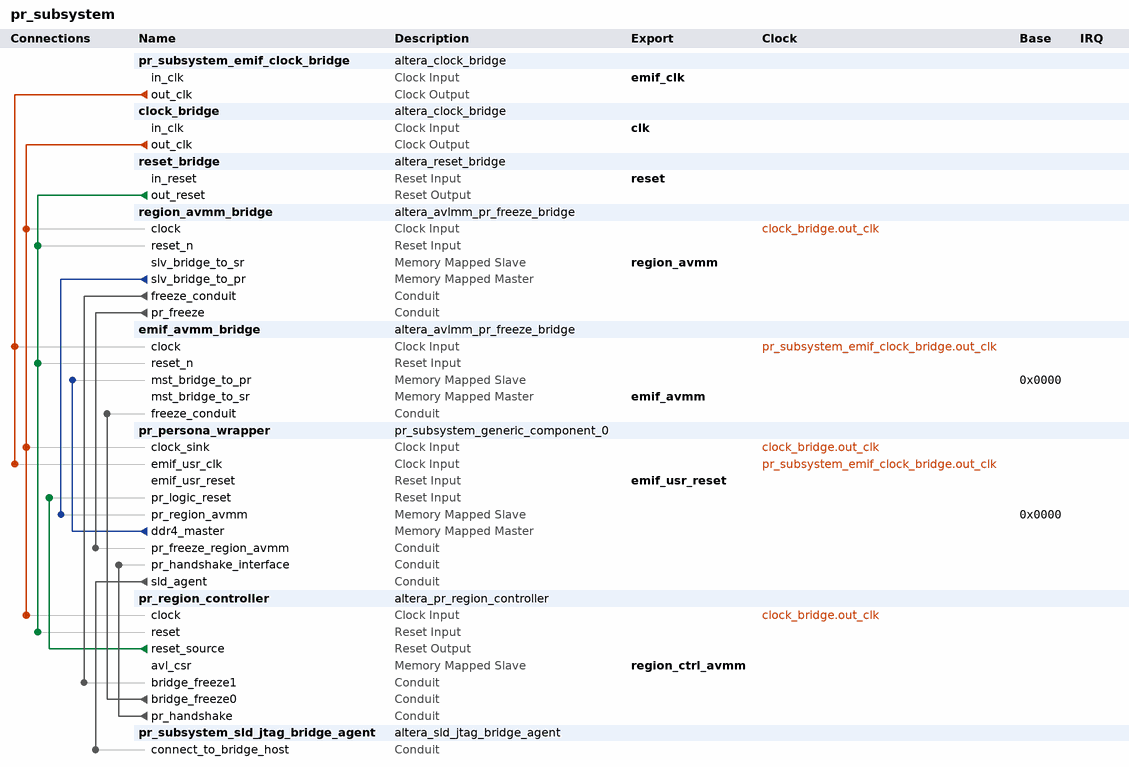
[diagram p0: system contents]
# Platform Designer (Qsys) system pr_subsystem, Arria 10 10AX115S2F45I1SG
# Parameters at their usual value, and those the tool derives, are not listed.
package require -exact qsys 1.0
create_system pr_subsystem
set_project_property DEVICE_FAMILY {Arria 10}
set_project_property DEVICE 10AX115S2F45I1SG

add_component pr_subsystem_emif_clock_bridge ip/pr_subsystem/pr_subsystem_emif_clock_bridge.ip altera_clock_bridge pr_subsystem_emif_clock_bridge 18.1
load_component pr_subsystem_emif_clock_bridge
set_component_parameter_value DERIVED_CLOCK_RATE 266666750
set_component_parameter_value EXPLICIT_CLOCK_RATE 0
save_component

add_component clock_bridge ip/pr_subsystem/pr_subsystem_clock_bridge_0.ip altera_clock_bridge clock_bridge 18.1
load_component clock_bridge
set_component_parameter_value DERIVED_CLOCK_RATE 250000000
set_component_parameter_value EXPLICIT_CLOCK_RATE 0
save_component

add_component reset_bridge ip/pr_subsystem/pr_subsystem_reset_bridge_0.ip altera_reset_bridge reset_bridge 18.1
load_component reset_bridge
set_component_parameter_value ACTIVE_LOW_RESET 1
set_component_parameter_value SYNCHRONOUS_EDGES none
set_component_parameter_value SYNC_RESET 0
save_component

add_component region_avmm_bridge ip/pr_subsystem/pr_subsystem_freeze_bridge_cra.ip altera_avlmm_pr_freeze_bridge region_avmm_bridge 18.1
load_component region_avmm_bridge
set_component_parameter_value Interface_Type {Avalon-MM Slave}
set_component_parameter_value ENABLE_FREEZE_FROM_PR_REGION true
set_component_parameter_value ENABLE_TRAFFIC_TRACKING false
set_component_parameter_value slv_bridge_signal_name_DERIVED address,beginbursttransfer,byteenable,debugaccess,read,write,readdata,writedata,waitrequest,readdatavalid,burstcount,response,lock,writeresponsevalid
set_component_parameter_value slv_bridge_signal_Enable Yes,No,Yes,Yes,Yes,Yes,Yes,Yes,Yes,Yes,Yes,No,No,No
set_component_parameter_value SLV_BRIDGE_ADDR_WIDTH 16
set_component_parameter_value SLV_BRIDGE_SYMBOL_WIDTH 8
set_component_parameter_value SLV_BRIDGE_BYTEEN_WIDTH 4
set_component_parameter_value SLV_BRIDGE_BURSTCOUNT_WIDTH 1
set_component_parameter_value SLV_BRIDGE_BURST_LINEWRAP false
set_component_parameter_value SLV_BRIDGE_CONSTANTBURSTBEHAVIOR false
set_component_parameter_value SLV_BRIDGE_BURST_BNDR_ONLY false
set_component_parameter_value SLV_BRIDGE_MAX_PENDING_READS 1
set_component_parameter_value SLV_BRIDGE_MAX_PENDING_WRITES 0
set_component_parameter_value SLV_BRIDGE_FIX_READ_LATENCY 0
set_component_parameter_value SLV_BRIDGE_READ_WAIT_TIME 1
set_component_parameter_value SLV_BRIDGE_WRITE_WAIT_TIME 0
set_component_parameter_value SLV_BRIDGE_ADDRESS_UNITS SYMBOLS
set_component_parameter_value mst_bridge_signal_name_DERIVED address,beginbursttransfer,byteenable,debugaccess,read,write,readdata,writedata,waitrequest,readdatavalid,burstcount,response,lock,writeresponsevalid
set_component_parameter_value mst_bridge_signal_Enable Yes,Yes,Yes,Yes,Yes,Yes,Yes,Yes,Yes,Yes,Yes,Yes,Yes,Yes
set_component_parameter_value MST_BRIDGE_ADDR_WIDTH 32
set_component_parameter_value MST_BRIDGE_SYMBOL_WIDTH 8
set_component_parameter_value MST_BRIDGE_BYTEEN_WIDTH 4
set_component_parameter_value MST_BRIDGE_BURSTCOUNT_WIDTH 3
set_component_parameter_value MST_BRIDGE_BURST_LINEWRAP true
set_component_parameter_value MST_BRIDGE_BURST_BNDR_ONLY true
set_component_parameter_value MST_BRIDGE_CONSTANTBURSTBEHAVIOR true
set_component_parameter_value MST_BRIDGE_MAX_PENDING_READS 1
set_component_parameter_value MST_BRIDGE_MAX_PENDING_WRITES 1
set_component_parameter_value MST_BRIDGE_FIX_READ_LATENCY 0
set_component_parameter_value MST_BRIDGE_READ_WAIT_TIME 1
set_component_parameter_value MST_BRIDGE_WRITE_WAIT_TIME 0
set_component_parameter_value MST_BRIDGE_ADDRESS_UNITS SYMBOLS
save_component

add_component emif_avmm_bridge ip/pr_subsystem/pr_subsystem_freeze_bridge_ddr4.ip altera_avlmm_pr_freeze_bridge emif_avmm_bridge 18.1
load_component emif_avmm_bridge
set_component_parameter_value Interface_Type {Avalon-MM Master}
set_component_parameter_value ENABLE_FREEZE_FROM_PR_REGION false
set_component_parameter_value ENABLE_TRAFFIC_TRACKING false
set_component_parameter_value slv_bridge_signal_name_DERIVED address,beginbursttransfer,byteenable,debugaccess,read,write,readdata,writedata,waitrequest,readdatavalid,burstcount,response,lock,writeresponsevalid
set_component_parameter_value slv_bridge_signal_Enable Yes,Yes,Yes,Yes,Yes,Yes,Yes,Yes,Yes,Yes,Yes,Yes,Yes,Yes
set_component_parameter_value SLV_BRIDGE_ADDR_WIDTH 32
set_component_parameter_value SLV_BRIDGE_SYMBOL_WIDTH 8
set_component_parameter_value SLV_BRIDGE_BYTEEN_WIDTH 4
set_component_parameter_value SLV_BRIDGE_BURSTCOUNT_WIDTH 3
set_component_parameter_value SLV_BRIDGE_BURST_LINEWRAP true
set_component_parameter_value SLV_BRIDGE_CONSTANTBURSTBEHAVIOR true
set_component_parameter_value SLV_BRIDGE_BURST_BNDR_ONLY true
set_component_parameter_value SLV_BRIDGE_MAX_PENDING_READS 1
set_component_parameter_value SLV_BRIDGE_MAX_PENDING_WRITES 1
set_component_parameter_value SLV_BRIDGE_FIX_READ_LATENCY 0
set_component_parameter_value SLV_BRIDGE_READ_WAIT_TIME 1
set_component_parameter_value SLV_BRIDGE_WRITE_WAIT_TIME 0
set_component_parameter_value SLV_BRIDGE_ADDRESS_UNITS SYMBOLS
set_component_parameter_value mst_bridge_signal_name_DERIVED address,beginbursttransfer,byteenable,debugaccess,read,write,readdata,writedata,waitrequest,readdatavalid,burstcount,response,lock,writeresponsevalid
set_component_parameter_value mst_bridge_signal_Enable Yes,No,Yes,No,Yes,Yes,Yes,Yes,Yes,Yes,Yes,No,No,No
set_component_parameter_value MST_BRIDGE_ADDR_WIDTH 25
set_component_parameter_value MST_BRIDGE_SYMBOL_WIDTH 8
set_component_parameter_value MST_BRIDGE_BYTEEN_WIDTH 64
set_component_parameter_value MST_BRIDGE_BURSTCOUNT_WIDTH 7
set_component_parameter_value MST_BRIDGE_BURST_LINEWRAP false
set_component_parameter_value MST_BRIDGE_BURST_BNDR_ONLY false
set_component_parameter_value MST_BRIDGE_CONSTANTBURSTBEHAVIOR false
set_component_parameter_value MST_BRIDGE_MAX_PENDING_READS 64
set_component_parameter_value MST_BRIDGE_MAX_PENDING_WRITES 0
set_component_parameter_value MST_BRIDGE_FIX_READ_LATENCY 0
set_component_parameter_value MST_BRIDGE_READ_WAIT_TIME 1
set_component_parameter_value MST_BRIDGE_WRITE_WAIT_TIME 0
set_component_parameter_value MST_BRIDGE_ADDRESS_UNITS WORDS
save_component

add_component pr_persona_wrapper {} pr_subsystem_generic_component_0 pr_persona_wrapper 1.0

add_component pr_region_controller ip/pr_subsystem/pr_subsystem_pr_region_controller_0.ip altera_pr_region_controller pr_region_controller 18.1
load_component pr_region_controller
set_component_parameter_value ENABLE_CSR true
set_component_parameter_value ENABLE_IRQ false
set_component_parameter_value NUM_INTF_BRIDGE 2
set_component_parameter_value ENABLE_PR_REGION_FREEZE false
set_component_parameter_value NUM_PR_REGION_RAM 1
save_component

add_component pr_subsystem_sld_jtag_bridge_agent ip/pr_subsystem/pr_subsystem_sld_jtag_bridge_agent.ip altera_sld_jtag_bridge_agent pr_subsystem_sld_jtag_bridge_agent 18.1
load_component pr_subsystem_sld_jtag_bridge_agent
set_component_parameter_value INSTANCE_INDEX -1
save_component

# connections
add_connection clock_bridge.out_clk pr_persona_wrapper.clock_sink clock
add_connection clock_bridge.out_clk pr_region_controller.clock clock
add_connection clock_bridge.out_clk region_avmm_bridge.clock clock
add_connection pr_subsystem_emif_clock_bridge.out_clk emif_avmm_bridge.clock clock
add_connection pr_subsystem_emif_clock_bridge.out_clk pr_persona_wrapper.emif_usr_clk clock
add_connection pr_region_controller.reset_source pr_persona_wrapper.pr_logic_reset reset
add_connection reset_bridge.out_reset emif_avmm_bridge.reset_n reset
add_connection reset_bridge.out_reset pr_region_controller.reset reset
add_connection reset_bridge.out_reset region_avmm_bridge.reset_n reset
add_connection pr_persona_wrapper.ddr4_master emif_avmm_bridge.mst_bridge_to_pr avalon
set_connection_parameter_value pr_persona_wrapper.ddr4_master/emif_avmm_bridge.mst_bridge_to_pr baseAddress 0x0000
add_connection region_avmm_bridge.slv_bridge_to_pr pr_persona_wrapper.pr_region_avmm avalon
set_connection_parameter_value region_avmm_bridge.slv_bridge_to_pr/pr_persona_wrapper.pr_region_avmm baseAddress 0x0000
add_connection pr_persona_wrapper.sld_agent pr_subsystem_sld_jtag_bridge_agent.connect_to_bridge_host conduit
add_connection pr_region_controller.bridge_freeze0 emif_avmm_bridge.freeze_conduit conduit
add_connection pr_region_controller.pr_handshake pr_persona_wrapper.pr_handshake_interface conduit
add_connection region_avmm_bridge.freeze_conduit pr_region_controller.bridge_freeze1 conduit
add_connection region_avmm_bridge.pr_freeze pr_persona_wrapper.pr_freeze_region_avmm conduit

# exported interfaces
add_interface clk clock sink
set_interface_property clk EXPORT_OF clock_bridge.in_clk
add_interface emif_avmm avalon master
set_interface_property emif_avmm EXPORT_OF emif_avmm_bridge.mst_bridge_to_sr
add_interface emif_clk clock sink
set_interface_property emif_clk EXPORT_OF pr_subsystem_emif_clock_bridge.in_clk
add_interface emif_usr_reset reset sink
set_interface_property emif_usr_reset EXPORT_OF pr_persona_wrapper.emif_usr_reset
add_interface region_avmm avalon slave
set_interface_property region_avmm EXPORT_OF region_avmm_bridge.slv_bridge_to_sr
add_interface region_ctrl_avmm avalon slave
set_interface_property region_ctrl_avmm EXPORT_OF pr_region_controller.avl_csr
add_interface reset reset sink
set_interface_property reset EXPORT_OF reset_bridge.in_reset

set_interconnect_requirement {$system} qsys_mm.clockCrossingAdapter HANDSHAKE
set_interconnect_requirement {$system} qsys_mm.enableEccProtection FALSE
set_interconnect_requirement {$system} qsys_mm.insertDefaultSlave FALSE
set_interconnect_requirement {$system} qsys_mm.maxAdditionalLatency 1

save_system pr_subsystem.qsys
